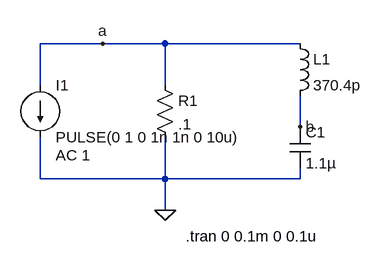
[diagram p0: schematic 3f.asc]
3f.asc, the LTspice schematic file:
Version 4
SHEET 1 880 680
WIRE -128 -16 -224 -16
WIRE -32 -16 -128 -16
WIRE 176 -16 -32 -16
WIRE -224 48 -224 -16
WIRE -32 48 -32 -16
WIRE 176 112 176 64
WIRE -224 192 -224 128
WIRE -32 192 -32 128
WIRE -32 192 -224 192
WIRE 176 192 176 176
WIRE 176 192 -32 192
WIRE -32 240 -32 192
FLAG -32 240 0
FLAG -128 -16 a
FLAG 176 112 b
SYMBOL cap 160 112 R0
SYMATTR InstName C1
SYMATTR Value 1.1µ
SYMBOL ind 160 -32 R0
SYMATTR InstName L1
SYMATTR Value 370.4p
SYMBOL current -224 48 R0
WINDOW 123 24 108 Left 2
WINDOW 39 0 0 Left 2
SYMATTR Value2 AC 1
SYMATTR InstName I1
SYMATTR Value PULSE(0 1 0 1n 1n 0 10u)
SYMBOL res -48 32 R0
SYMATTR InstName R1
SYMATTR Value .1
TEXT 0 280 Left 2 !.tran 0 0.1m 0 0.1u

The netlist it stands for:
* 3f.asc
C1 b 0 1.1µ
L1 a b 370.4p
I1 a 0 PULSE(0 1 0 1n 1n 0 10u) AC 1
R1 a 0 .1
.tran 0 0.1m 0 0.1u
.backanno
.end

* Results of the author's LTspice run, read from the files saved beside the schematic
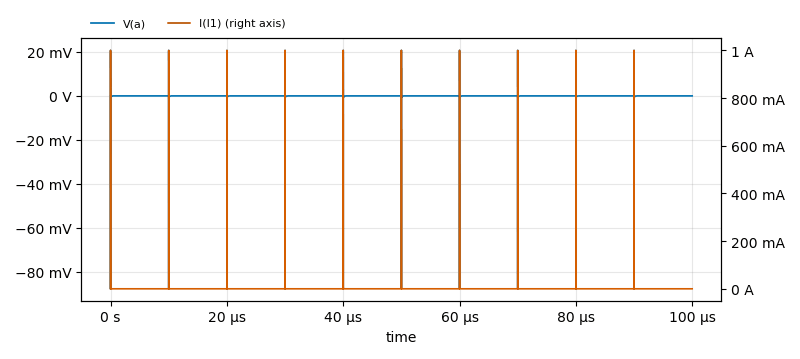
[diagram p1: Transient Analysis of 3f.asc, plotted from the saved traces]
* Transient Analysis, 1 run:
*   V(a): min -87.64 mV, max 20.68 mV, average -10.02 µV, rms 749.7 µV, last 0 V
*   I(I1): min 0 A, max 1 A, average 100 µA, rms 8.224 mA, last 0 A